# EAGLE design ioboard (EAGLE 9.6.2)
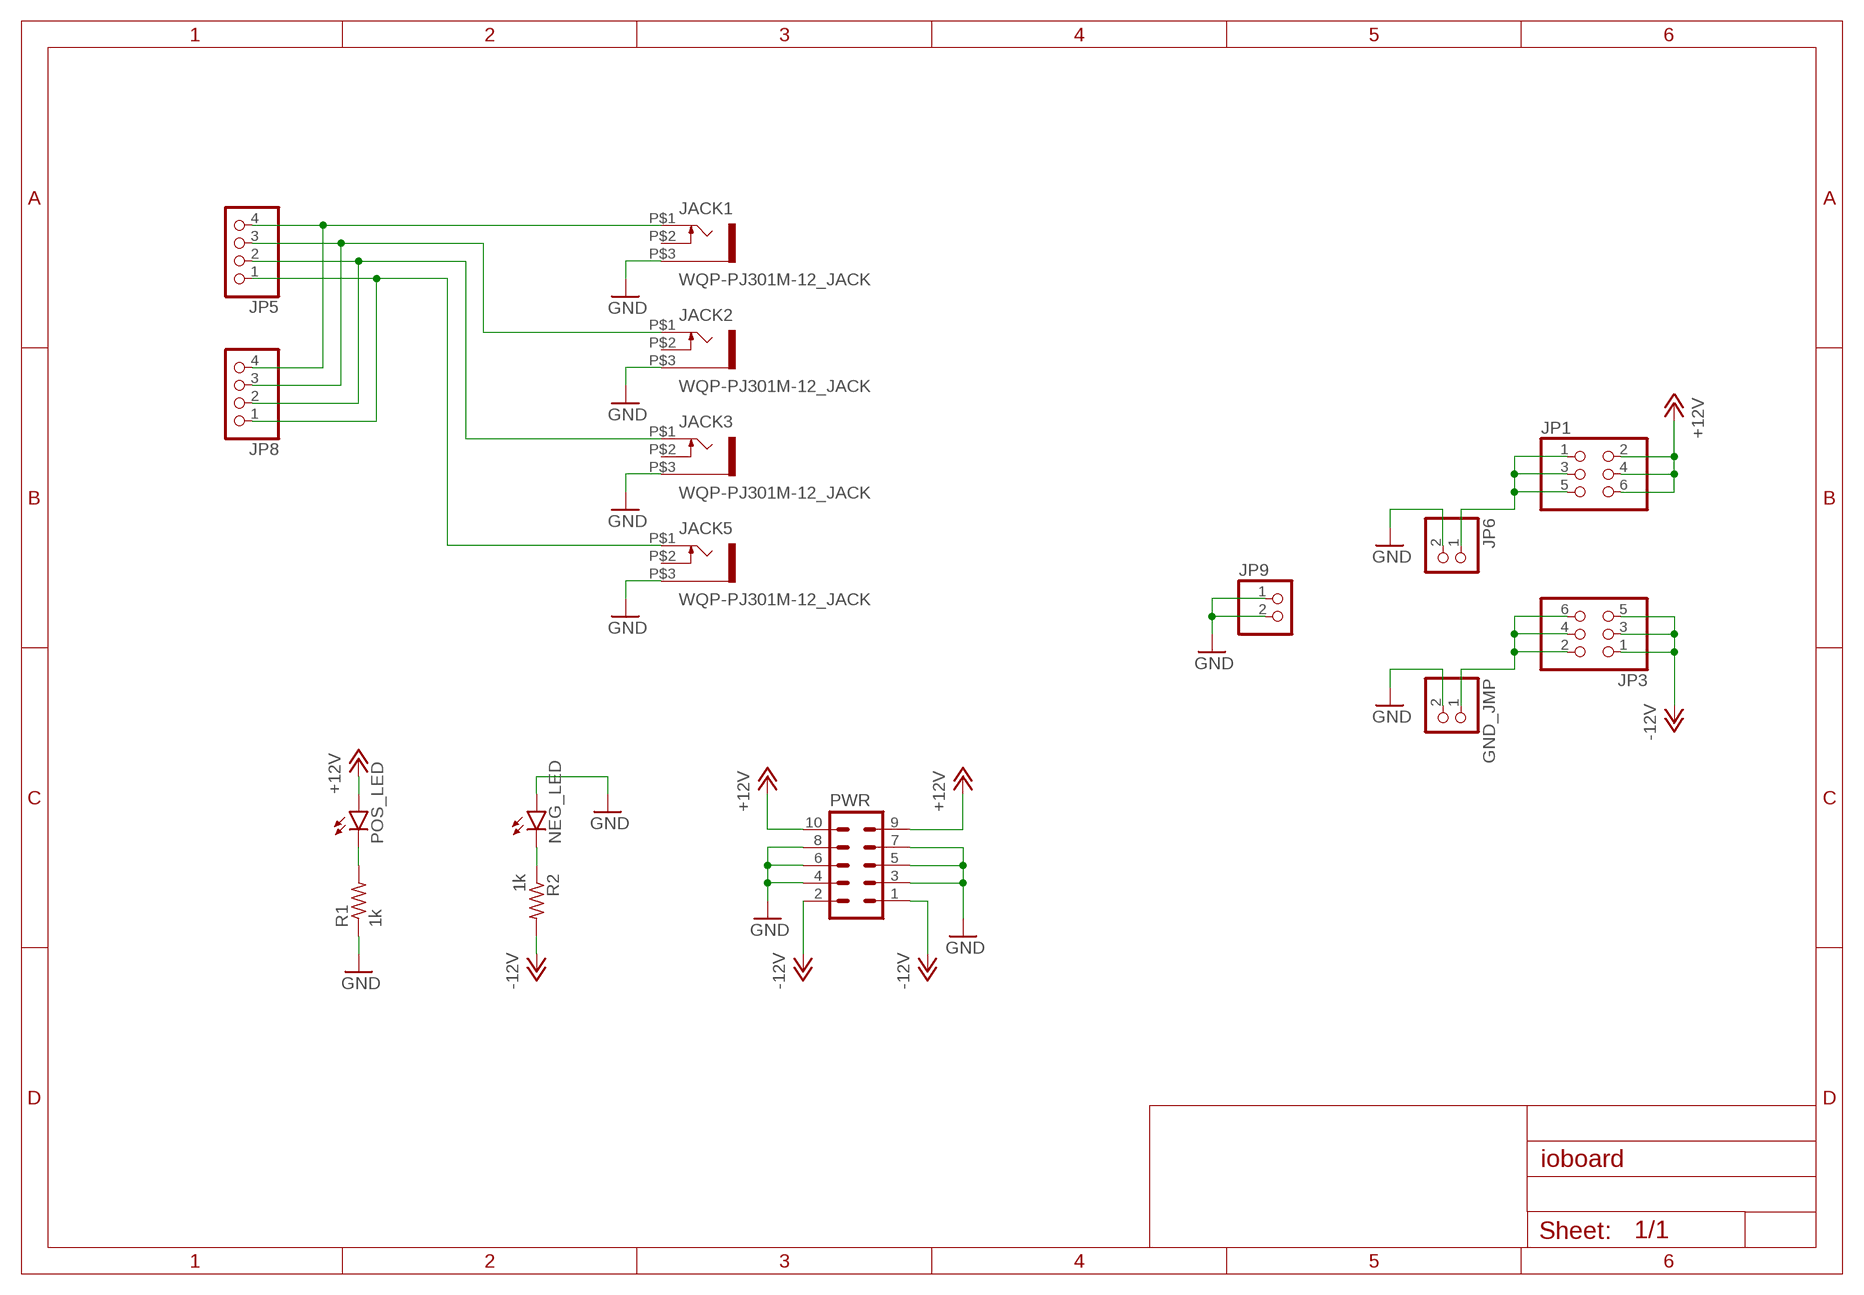
[diagram p0: schematic, sheet 1]

## Parts
GND_JMP  PINHD-1X2  [1X02]
JACK1  WQP-PJ301M-12_JACK  [WQP-PJ301M-12_JACK]
JACK2  WQP-PJ301M-12_JACK  [WQP-PJ301M-12_JACK]
JACK3  WQP-PJ301M-12_JACK  [WQP-PJ301M-12_JACK]
JACK5  WQP-PJ301M-12_JACK  [WQP-PJ301M-12_JACK]
JP1  PINHD-2X3  [2X03]
JP3  PINHD-2X3  [2X03]
JP5  PINHD-1X4  [1X04]
JP6  PINHD-1X2  [1X02]
JP8  PINHD-1X4  [1X04]
JP9  PINHD-1X2  [1X02]
NEG_LED  LED3MM  [LED3MM]
POS_LED  LED3MM  [LED3MM]
PWR  ML10  [ML10]
R1  1k  R-US_0207/7  [0207/7]
R2  1k  R-US_0207/7  [0207/7]

## Nets
+12V: JP1.2 JP1.4 JP1.6 POS_LED.A PWR.9 PWR.10
-12V: JP3.1 JP3.3 JP3.5 PWR.1 PWR.2 R2.2
GND: GND_JMP.2 JACK1.P$3 JACK2.P$3 JACK3.P$3 JACK5.P$3 JP6.2 JP9.1 JP9.2 NEG_LED.A PWR.3 PWR.4 PWR.5 PWR.6 PWR.7 PWR.8 R1.1
N$1: POS_LED.K(C) R1.2
N$2: NEG_LED.K(C) R2.1
N$3: JACK1.P$1 JP5.4 JP8.4
N$5: JACK3.P$1 JP5.2 JP8.2
N$6: JP1.1 JP1.3 JP1.5 JP6.1
N$7: JACK5.P$1 JP5.1 JP8.1
N$9: GND_JMP.1 JP3.2 JP3.4 JP3.6
N$10: JACK2.P$1 JP5.3 JP8.3
Unconnected: JACK1.P$2 JACK2.P$2 JACK3.P$2 JACK5.P$2

## Library data of the parts
GND_JMP JP6 JP9 = pinhead:PINHD-1X2: PIN HEADER
JACK1-JACK3 JACK5 = thonkiconn:WQP-PJ301M-12_JACK
JP1 JP3 = pinhead:PINHD-2X3: PIN HEADER
JP5 JP8 = pinhead:PINHD-1X4: PIN HEADER
NEG_LED POS_LED = led:LED: LED OSRAM: - CHIPLED LG R971, LG N971, LY N971, LG Q971, LY Q971, LO R971, LY R971 LH N974, LH R974 LS Q976, LO Q976, LY Q976 LO Q996 - Hyper CHIPLED LW Q18S LB Q993, LB Q99A, LB R99A - SideLED LS A670, LO A670, LY A670, LG A670, LP A670 LB A673, LV A673, LT A673, LW A673 LH A674 LY A675 LS A676, LA A676, LO A676, LY A676, LW A676 LS A679, LY A679, LG A679 - Hyper Micro SIDELED® LS Y876, LA Y876, LO Y876, LY Y876 LT Y87S - SmartLED LW L88C, LW L88S LB L89C, LB L89S, LG L890 LS L89K, LO L89K, LY L89K LS L896, LA L896, LO L896, LY L896 - TOPLED LS T670, LO T670, LY T670, LG T670, LP T670 LSG T670, LSP T670, LSY T670, LOP T670, LYG T670 LG T671, LOG T671, LSG T671 LB T673, LV T673, LT T673, LW T673 LH T674 LS T676, LA T676, LO T676, LY T676, LB T676, LH T676, LSB T676, LW T676 LB T67C, LV T67C, LT T67C, LS T67K, LO T67K, LY T67K, LW E67C LS E67B, LA E67B, LO E67B, LY E67B, LB E67C, LV E67C, LT E67C LW T67C LS T679, LY T679, LG T679 LS T770, LO T770, LY T770, LG T770, LP T770 LB T773, LV T773, LT T773, LW T773 LH T774 LS E675, LA E675, LY E675, LS T675 LS T776, LA T776, LO T776, LY T776, LB T776 LHGB T686 LT T68C, LB T68C - Hyper Mini TOPLED® LB M676 - Mini TOPLED Santana® LG M470 LS M47K, LO M47K, LY M47K Source: http://www.osram.convergy.de LUXEON: - LUMILED® LXK2-PW12-R00, LXK2-PW12-S00, LXK2-PW14-U00, LXK2-PW14-V00 LXK2-PM12-R00, LXK2-PM12-S00, LXK2-PM14-U00 LXK2-PE12-Q00, LXK2-PE12-R00, LXK2-PE12-S00, LXK2-PE14-T00, LXK2-PE14-U00 LXK2-PB12-K00, LXK2-PB12-L00, LXK2-PB12-M00, LXK2-PB14-N00, LXK2-PB14-P00, LXK2-PB14-Q00 LXK2-PR12-L00, LXK2-PR12-M00, LXK2-PR14-Q00, LXK2-PR14-R00 LXK2-PD12-Q00, LXK2-PD12-R00, LXK2-PD12-S00 LXK2-PH12-R00, LXK2-PH12-S00 LXK2-PL12-P00, LXK2-PL12-Q00, LXK2-PL12-R00 Source: www.luxeon.com KINGBRIGHT: KA-3528ASYC Source: www.kingbright.com
PWR = con-ml:ML10: HARTING; OC_FARNELL: unknown; OC_NEWARK: unknown
R1 R2 = rcl:R-US_: RESISTOR, American symbol; SPICEPREFIX: R

## Board
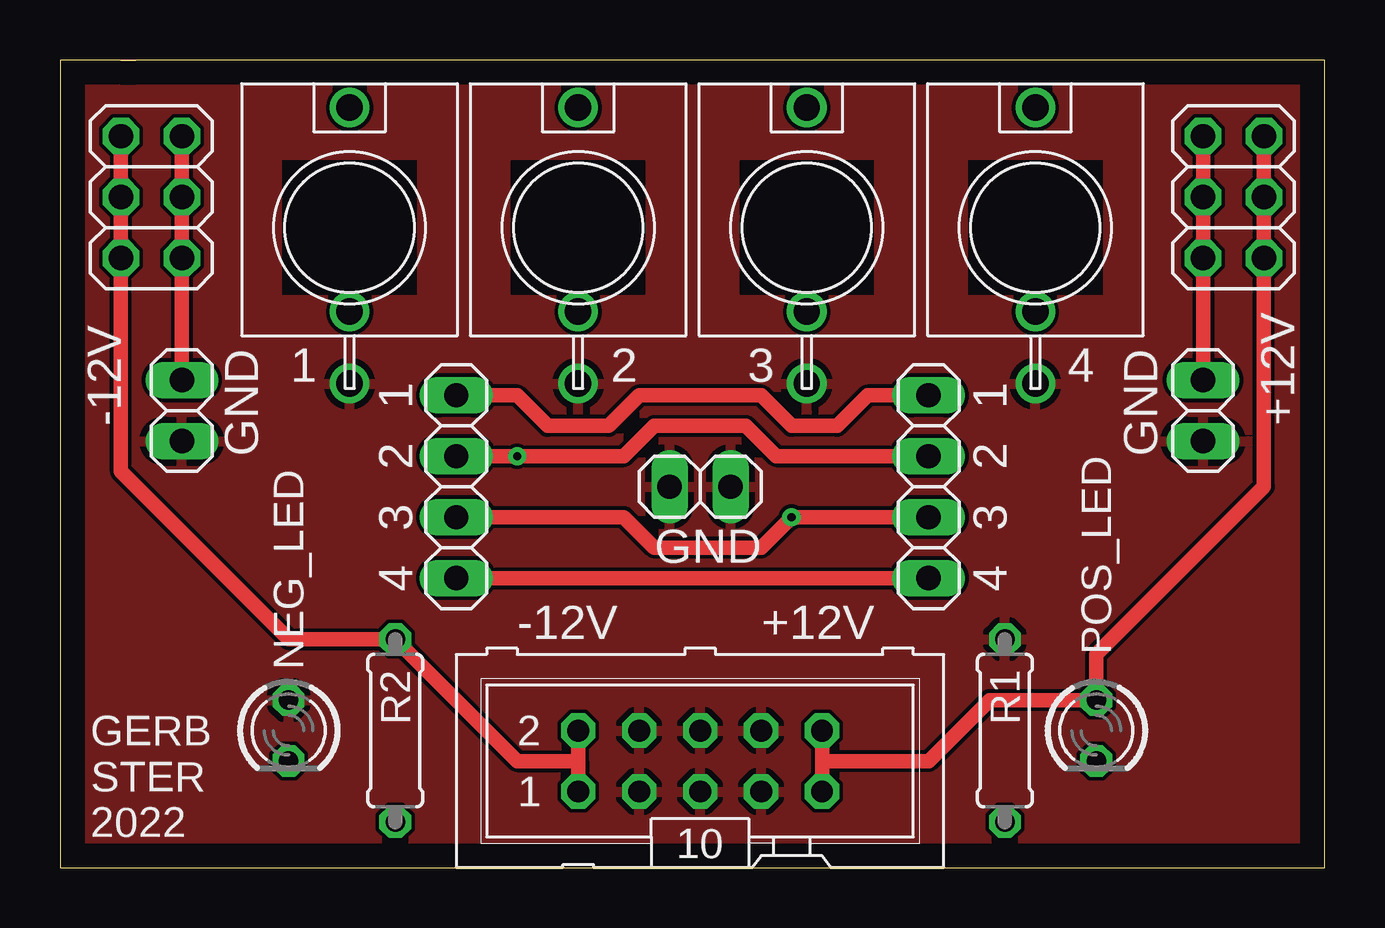
[diagram p1: board, top side]
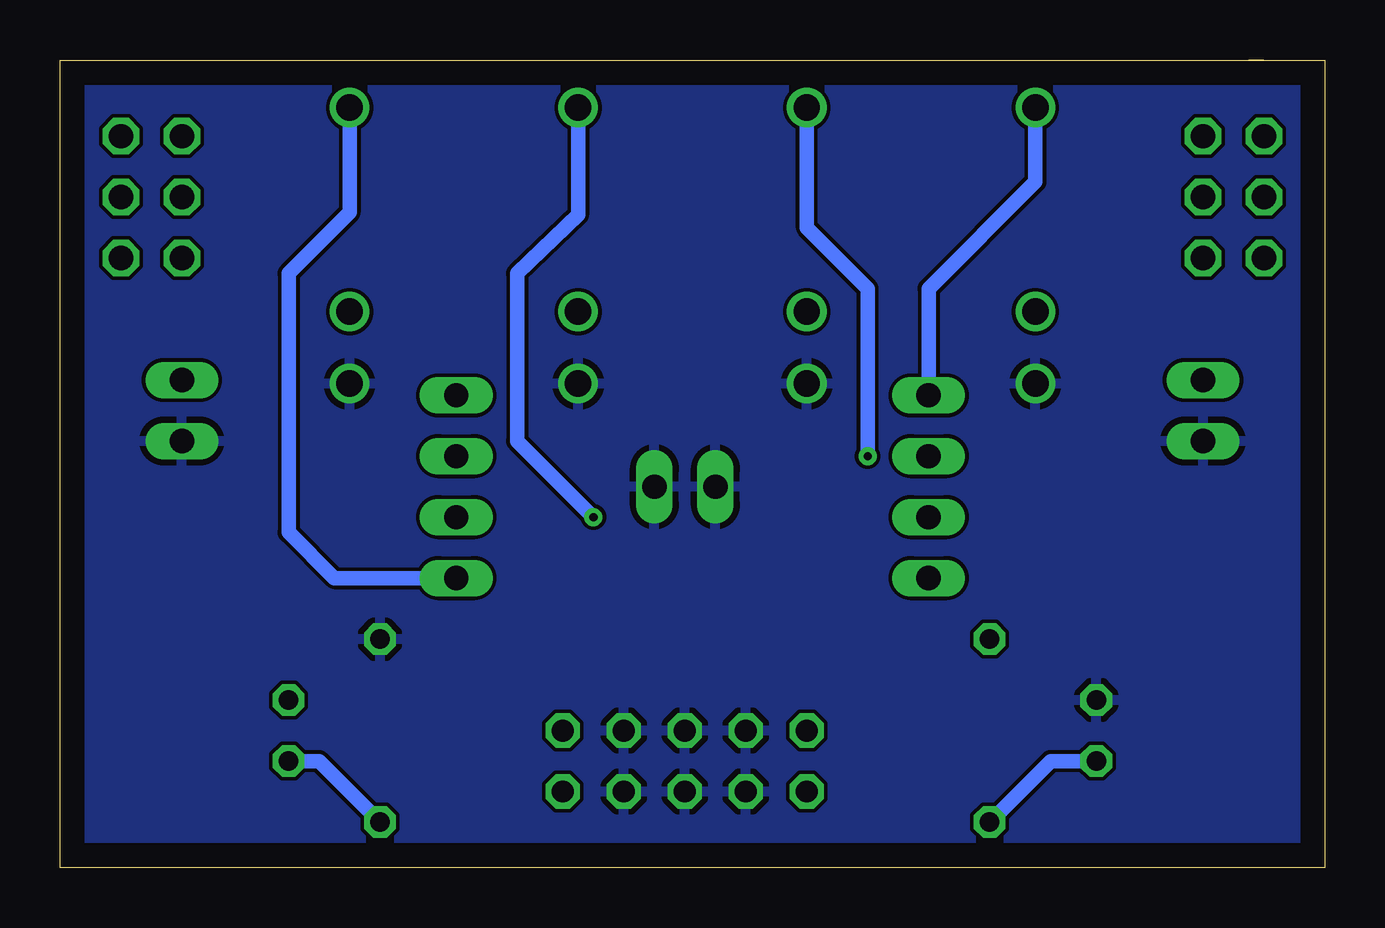
[diagram p2: board, bottom side, seen from below]

Size 52.7 x 33.66 mm. Coordinates in mm from the lower left corner, seen from the top.
Outline: 0,0 52.7,0 52.7,33.66 2.54,33.66 3.17,33.65 0,33.65 0,0
Copper layers (1*16): Top 0.035mm / dielectric 1.5mm / Bottom 0.035mm
Design rules "default": minimum track width 6mil, minimum drill 0.35mm, track to track 6mil, track to pad 6mil, pad to pad 6mil, via to via 6mil, smd to smd 6mil, copper to edge 40mil, drill to drill 6mil, minimum pad ring 10mil, minimum via ring 8mil, stop-mask expansion 4mil, vias tented up to drill 0mil, thermal gap 10mil

### Footprints (pad centres in the part's own frame; a part is rotated, then mirrored left to right if it is on the bottom)
1X02 = drill 1.016 long: 1 -1.27,0; 2 1.27,0
WQP-PJ301M-12_JACK = drill 1.1: P$1 0,5; P$2 0,-3.5; P$3 0,-6.5
2X03 = drill 1.016 octagon: 1 -2.54,-1.27; 2 -2.54,1.27; 3 0,-1.27; 4 0,1.27; 5 2.54,-1.27; 6 2.54,1.27
1X04 = drill 1.016 long: 1 -3.81,0; 2 -1.27,0; 3 1.27,0; 4 3.81,0
LED3MM = drill 0.813 octagon: A -1.27,0; K 1.27,0
ML10 = drill 0.914 octagon: 1 -5.08,-1.27; 2 -5.08,1.27; 3 -2.54,-1.27; 4 -2.54,1.27; 5 0,-1.27; 6 0,1.27; 7 2.54,-1.27; 8 2.54,1.27; 9 5.08,-1.27; 10 5.08,1.27
0207/7 = drill 0.813 octagon: 1 -3.81,0; 2 3.81,0

### Placement (x,y rotation side)
GND_JMP  5.08,19.05 270 top
JACK1  12.06,26.67 0 top
JACK2  21.59,26.67 0 top
JACK3  31.11,26.67 0 top
JACK5  40.64,26.67 0 top
JP1  48.9,27.94 270 top
JP3  3.81,27.94 270 top
JP5  36.2,15.88 90 top
JP6  47.62,19.05 270 top
JP8  16.51,15.88 90 top
JP9  26.67,15.88 0 top
NEG_LED  9.53,5.71 270 top
POS_LED  43.18,5.71 270 top
PWR  26.67,4.45 0 top
R1  39.37,5.71 270 top
R2  13.97,5.71 90 top

### Tracks (layer width: path | path; a pad name or v marks a point on that pad's centre or on a via)
+12V
  Top 0.61: PWR.9 31.75,4.45 | 31.75,4.45 PWR.10 | 31.75,4.45 36.2,4.45 38.73,6.99 POS_LED.A 43.18,8.89 50.16,15.88 JP1.6 JP1.4 JP1.2
-12V
  Top 0.61: 21.59,4.45 19.05,4.45 R2.2 9.53,9.53 2.54,16.51 JP3.5 JP3.3 JP3.1 | 21.59,4.45 PWR.2 | 21.59,4.45 PWR.1
GND
  pour Bottom: 0,0 0,33.66 52.7,33.66 52.7,0
  pour Top: 0,0 0,33.66 52.7,33.66 52.7,0
N$1
  Bottom 0.61: R1.2 41.91,4.45 POS_LED.K
N$2
  Bottom 0.61: NEG_LED.K 11.43,4.45 R2.1
N$3
  Top 0.61: JP5.4 33.66,19.68 32.38,18.41 30.48,18.41 29.21,19.68 24.13,19.68 22.86,18.41 20.32,18.41 19.05,19.68 JP8.4
  Bottom 0.61: JACK1.P$1 12.06,28.57 16.51,24.13 JP8.4
N$5  (via drill 0.35)
  Top 0.61: JP5.2 v30.48,14.61 29.21,13.34 24.77,13.34 23.5,14.61 JP8.2
  Bottom 0.61: JACK3.P$1 31.11,27.2 33.66,24.77 33.66,17.78 v30.48,14.61
N$6
  Top 0.61: JP6.1 JP1.5 JP1.3 JP1.1
N$7
  Top 0.61: JP8.1 JP5.1
  Bottom 0.61: JACK5.P$1 40.64,27.3 43.18,24.77 43.18,13.97 41.27,12.06 JP5.1
N$9
  Top 0.61: JP3.2 JP3.4 JP3.6 GND_JMP.1
N$10  (via drill 0.35)
  Top 0.61: JP8.3 v19.05,17.14 23.5,17.14 24.77,18.41 28.57,18.41 29.84,17.14 JP5.3
  Bottom 0.61: JACK2.P$1 21.59,26.67 19.05,24.13 v19.05,17.14

### Text on the board
tNames: 1 | 2 | 3 | 4 | 1 | 1 | -12V | +12V | GND | 2 | 2 | GND | 3 | 3 | GND | 4 | 4 | -12V | +12V | GERB / STER / 2022